# Altium schematic sheet Schematic.SchDoc
size A2; SheetNumber: 1; SheetTotal: 1
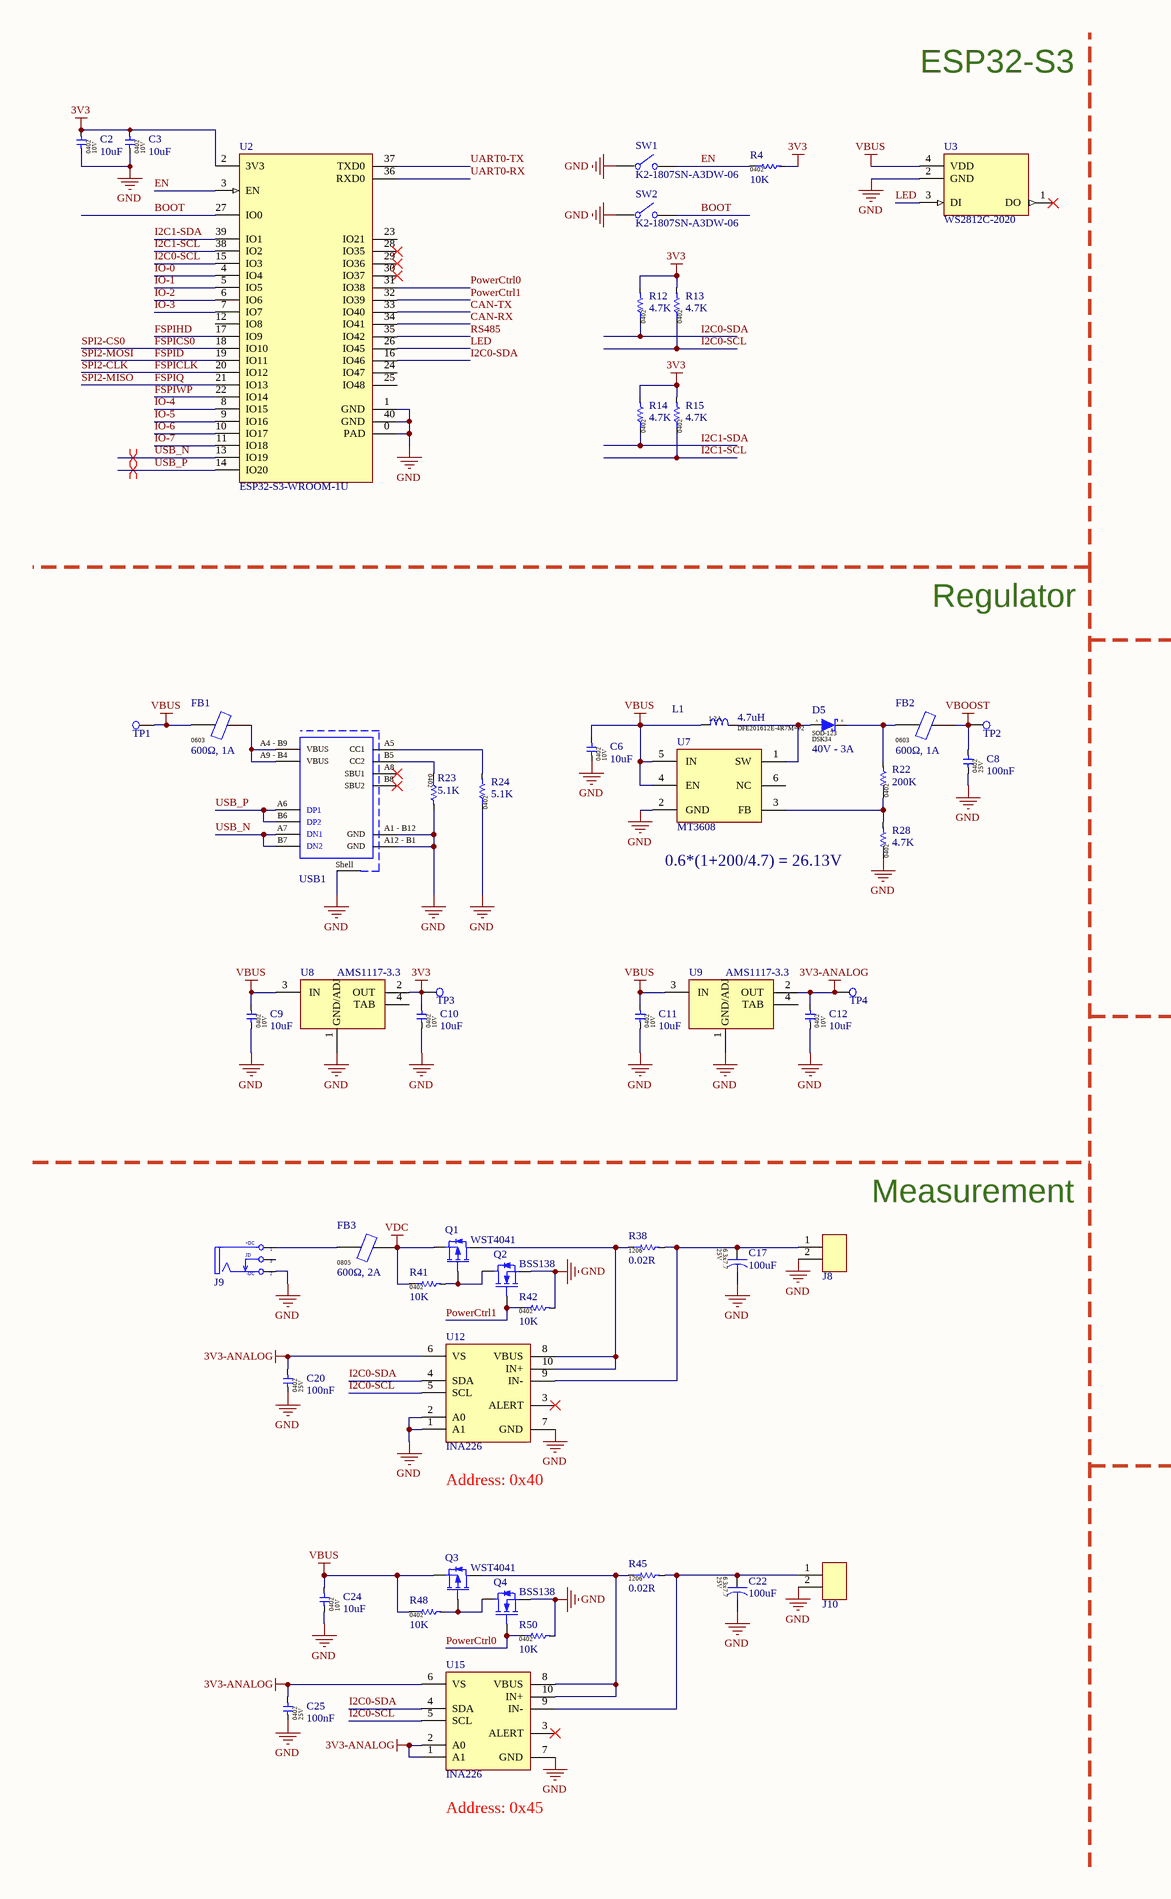
[diagram p0: Schematic.SchDoc, left]
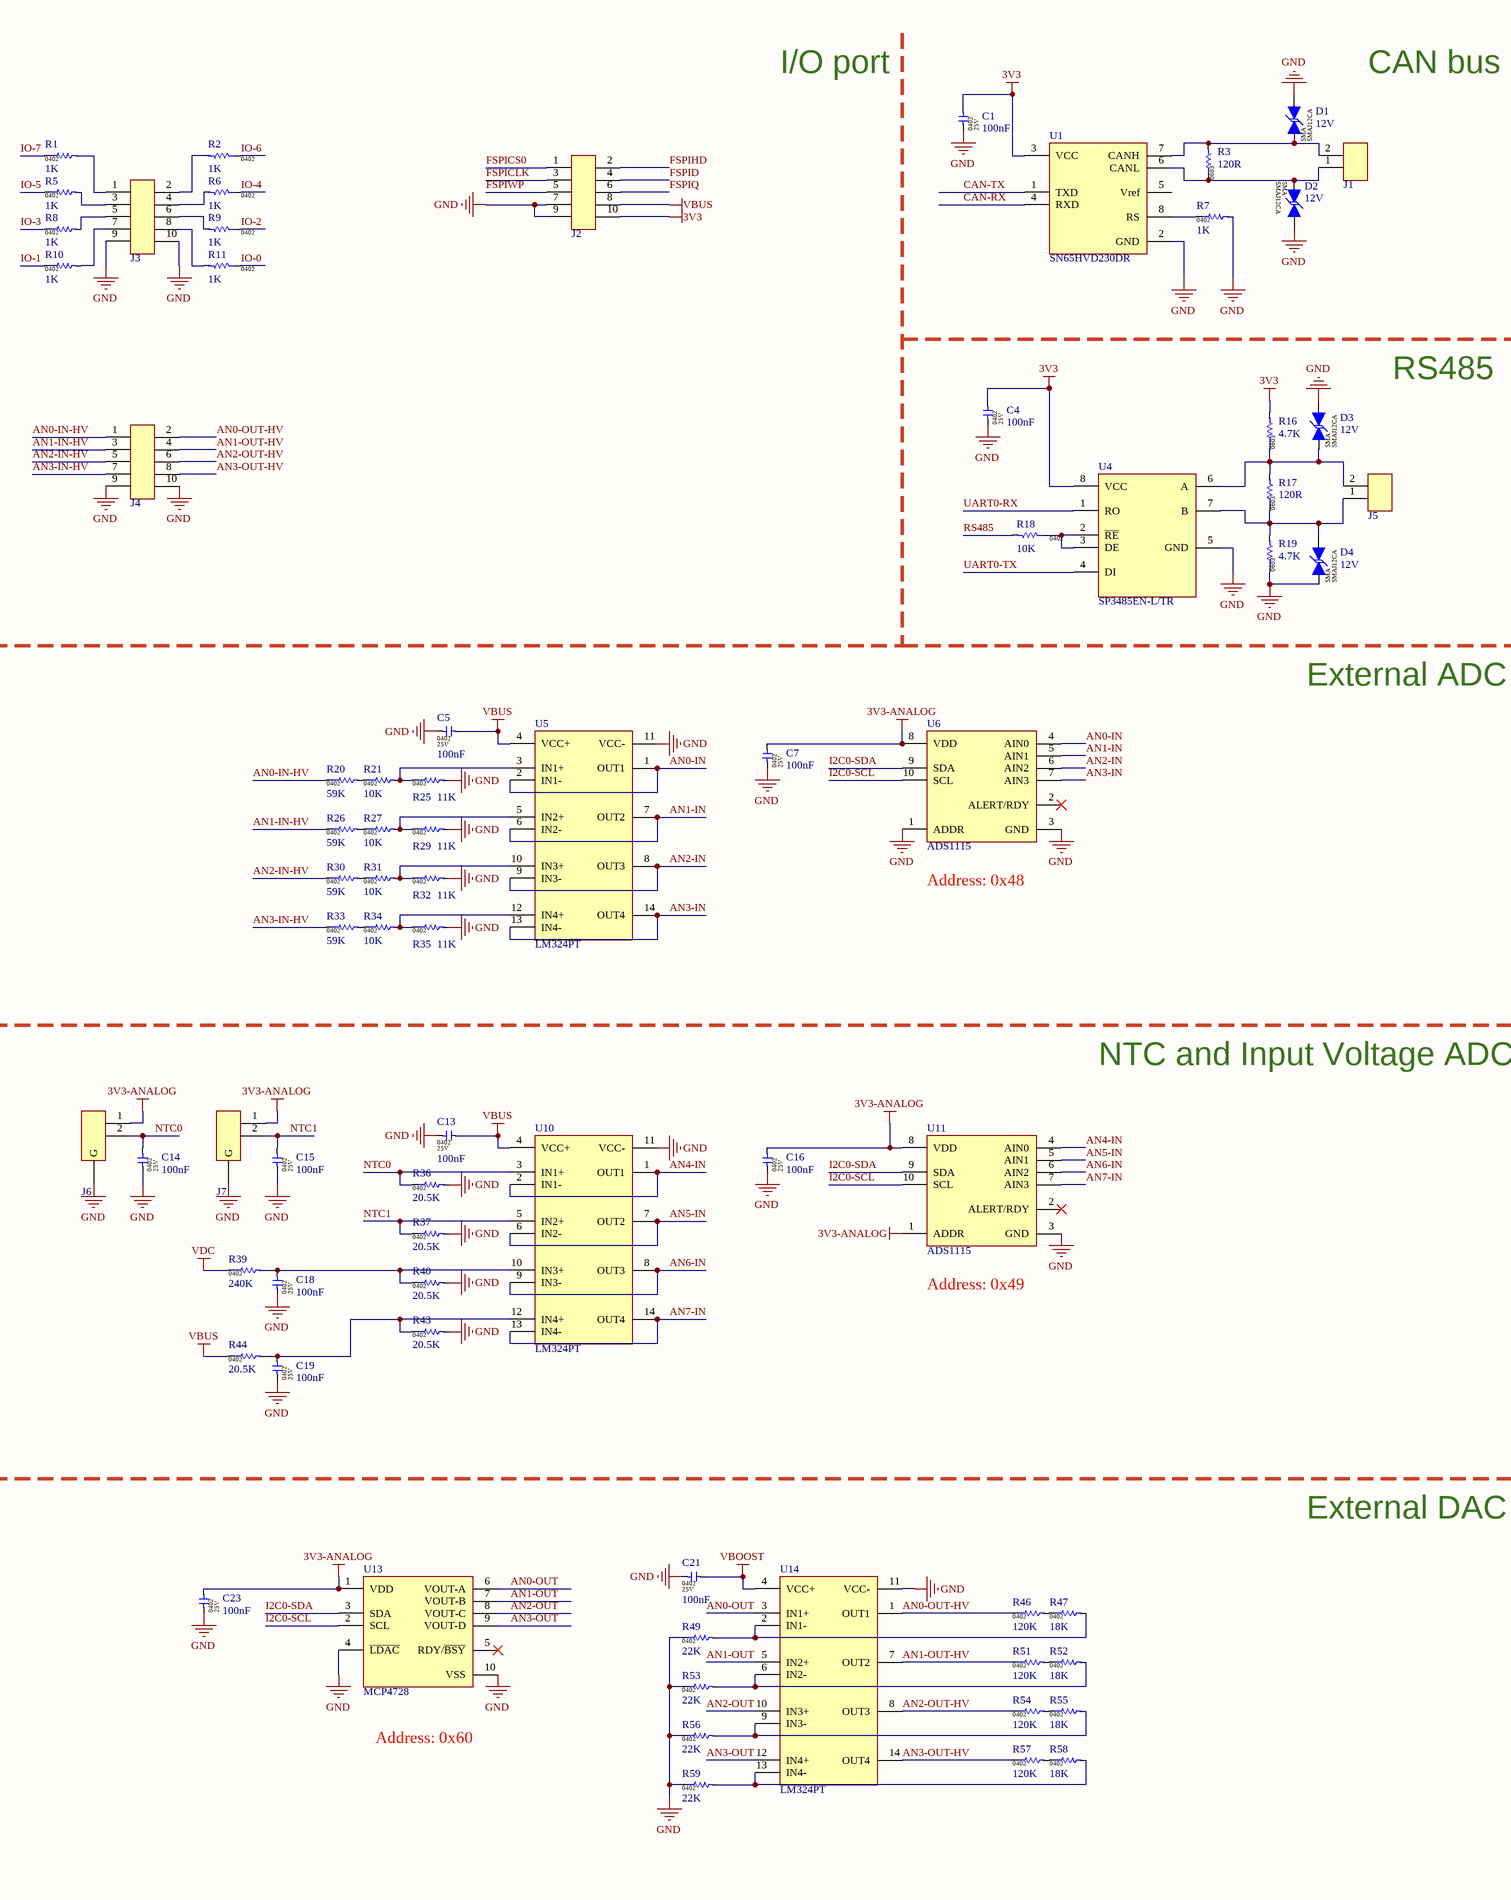
[diagram p1: Schematic.SchDoc, right]

## Parts
C1  100nF  [CAP-0402]
C2  10uF  [CAP-0402]
C3  10uF  [CAP-0402]
C4  100nF  [CAP-0402]
C5  100nF  [CAP-0402]
C6  10uF  [CAP-0402]
C7  100nF  [CAP-0402]
C8  100nF  [CAP-0402]
C9  10uF  [CAP-0402]
C10  10uF  [CAP-0402]
C11  10uF  [CAP-0402]
C12  10uF  [CAP-0402]
C13  100nF  [CAP-0402]
C14  100nF  [CAP-0402]
C15  100nF  [CAP-0402]
C16  100nF  [CAP-0402]
C17  100uF  [CAP-ALU-SMD-D]
C18  100nF  [CAP-0402]
C19  100nF  [CAP-0402]
C20  100nF  [CAP-0402]
C21  100nF  [CAP-0402]
C22  100uF  [CAP-ALU-SMD-D]
C23  100nF  [CAP-0402]
C24  10uF  [CAP-0402]
C25  100nF  [CAP-0402]
D1  12V  [SMA-DO-214AC (BI)]
D2  12V  [SMA-DO-214AC (BI)]
D3  12V  [SMA-DO-214AC (BI)]
D4  12V  [SMA-DO-214AC (BI)]
D5  40V - 3A  [SOD123]
FB1  600Ω, 1A  [Ferrite-0603]
FB2  600Ω, 1A  [Ferrite-0603]
FB3  600Ω, 2A  [Ferrite-0805]
J1  DB301V-5.0-2P-BU-S  [Terminal block 2P 5.0]  (value not drawn)
J2  IDC2.54-05-05PWS  [Conn IDC 10P-2.54H right]  (value not drawn)
J3  IDC2.54-05-05PWS  [Conn IDC 10P-2.54H right]  (value not drawn)
J4  IDC2.54-05-05PWS  [Conn IDC 10P-2.54H right]  (value not drawn)
J5  DB301V-5.0-2P-BU-S  [Terminal block 2P 5.0]  (value not drawn)
J6  S2B-XH-SM4-TB(LF)(SN)  [XH-2.54-2Pin-SMT]  (value not drawn)
J7  S2B-XH-SM4-TB(LF)(SN)  [XH-2.54-2Pin-SMT]  (value not drawn)
J8  DB301V-5.0-2P-BU-S  [Terminal block 2P 5.0]  (value not drawn)
J9  DC-044A-2.5A-2.0  [Jack DC 5.5-2.5mm]  (value not drawn)
J10  DB301V-5.0-2P-BU-S  [Terminal block 2P 5.0]  (value not drawn)
L1  4.7uH  [IND-201612]
Q1  WST4041  [SOT23-3]
Q2  BSS138  [SOT23-3]
Q3  WST4041  [SOT23-3]
Q4  BSS138  [SOT23-3]
R1  1K  [RES-0402]
R2  1K  [RES-0402]
R3  120R  [RES-0603]
R4  10K  [RES-0402]
R5  1K  [RES-0402]
R6  1K  [RES-0402]
R7  1K  [RES-0402]
R8  1K  [RES-0402]
R9  1K  [RES-0402]
R10  1K  [RES-0402]
R11  1K  [RES-0402]
R12  4.7K  [RES-0402]
R13  4.7K  [RES-0402]
R14  4.7K  [RES-0402]
R15  4.7K  [RES-0402]
R16  4.7K  [RES-0603]
R17  120R  [RES-0603]
R18  10K  [RES-0402]
R19  4.7K  [RES-0603]
R20  59K  [RES-0402]
R21  10K  [RES-0402]
R22  200K  [RES-0402]
R23  5.1K  [RES-0402]
R24  5.1K  [RES-0402]
R25  11K  [RES-0402]
R26  59K  [RES-0402]
R27  10K  [RES-0402]
R28  4.7K  [RES-0402]
R29  11K  [RES-0402]
R30  59K  [RES-0402]
R31  10K  [RES-0402]
R32  11K  [RES-0402]
R33  59K  [RES-0402]
R34  10K  [RES-0402]
R35  11K  [RES-0402]
R36  20.5K  [RES-0402]
R37  20.5K  [RES-0402]
R38  0.02R  [RES-1206]
R39  240K  [RES-0402]
R40  20.5K  [RES-0402]
R41  10K  [RES-0402]
R42  10K  [RES-0402]
R43  20.5K  [RES-0402]
R44  20.5K  [RES-0402]
R45  0.02R  [RES-1206]
R46  120K  [RES-0402]
R47  18K  [RES-0402]
R48  10K  [RES-0402]
R49  22K  [RES-0402]
R50  10K  [RES-0402]
R51  120K  [RES-0402]
R52  18K  [RES-0402]
R53  22K  [RES-0402]
R54  120K  [RES-0402]
R55  18K  [RES-0402]
R56  22K  [RES-0402]
R57  120K  [RES-0402]
R58  18K  [RES-0402]
R59  22K  [RES-0402]
SW1  K2-1807SN-A3DW-06  [SW - TYPE 3]
SW2  K2-1807SN-A3DW-06  [SW - TYPE 3]
TP1  N/A  [Test point]  (value not drawn)  (no BOM)
TP2  N/A  [Test point]  (value not drawn)  (no BOM)
TP3  N/A  [Test point]  (value not drawn)  (no BOM)
TP4  N/A  [Test point]  (value not drawn)  (no BOM)
U1  SN65HVD230DR  [SOP-8]
U2  ESP32-S3-WROOM-1U  [ESP32-S3-WROOM-1U]
U3  WS2812C-2020  [WS2812C-2020]
U4  SP3485EN-L/TR  [SOP-8]
U5  LM324PT  [TSSOP-14]
U6  ADS1115  [VSSOP-10]
U7  MT3608  [SOT23-6]
U8  AMS1117-3.3  [SOT223]
U9  AMS1117-3.3  [SOT223]
U10  LM324PT  [TSSOP-14]
U11  ADS1115  [VSSOP-10]
U12  INA226  [VSSOP-10]
U13  MCP4728  [MSOP-10]
U14  LM324PT  [TSSOP-14]
U15  INA226  [VSSOP-10]
USB1  918-418K2023S40001  [1 FEMALE USB -C 16]  (value not drawn)

## Nets
3V3: C1.2 C2.2 C3.2 C4.2 C10.2 J2.10 R4.2 R12.2 R13.2 R14.2 R15.2 R16.2 TP3.1 U1.3(VCC) U2.2(3V3) U4.8(VCC) U8.2(OUT)
3V3-ANALOG: C7.2 C12.2 C16.2 C20.2 C23.2 C25.2 J6.1 J7.1 TP4.1 U6.8(VDD) U9.2(OUT) U11.1(ADDR) U11.8(VDD) U12.6(VS) U13.1(VDD) U15.1(A1) U15.2(A0) U15.6(VS)
GND: C1.1 C2.1 C3.1 C4.1 C5.1 C6.1 C7.1 C8.1 C9.1 C10.1 C11.1 C12.1 C13.1 C14.1 C15.1 C16.1 C17.2 C18.1 C19.1 C20.1 C21.1 C22.2 C23.1 C24.1 C25.1 D1.2 D2.2 D3.2 D4.1 J2.7 J2.9 J3.9 J3.10 J4.9 J4.10 J6.0(G) J7.0(G) J8.2 J9.2(TN) J10.2 Q2.2(S) Q4.2(S) R7.2 R19.1 R23.2 R24.1 R25.2 R28.1 R29.2 R32.2 R35.2 R36.2 R37.2 R40.2 R42.2 R43.2 R49.1 R50.2 R53.1 R56.1 R59.1 SW1.1 SW2.1 U1.2(GND) U2.0(PAD) U2.1(GND) U2.40(GND) U3.2(GND) U4.5(GND) U5.11(VCC-) U6.1(ADDR) U6.3(GND) U7.2(GND) U8.1(GND/ADJ) U9.1(GND/ADJ) U10.11(VCC-) U11.3(GND) U12.1(A1) U12.2(A0) U12.7(GND) U13.4(~{LDAC}) U13.10(VSS) U14.11(VCC-) U15.7(GND) USB1.A1_-_B12(GND) USB1.A12_-_B1(GND) USB1.Shell(Shield)
VBOOST: C8.2 C21.2 FB2.2 TP2.1 U14.4(VCC+)
VBUS: C5.2 C6.2 C9.2 C11.2 C13.2 C24.2 FB1.1 J2.8 L1.2 Q3.2(S) R44.1 R48.1 TP1.1 U3.4(VDD) U5.4(VCC+) U7.4(EN) U7.5(IN) U8.3(IN) U9.3(IN) U10.4(VCC+)
VDC: FB3.2 Q1.2(S) R39.1 R41.1
AN0-IN: U5.1(OUT1) U5.2(IN1-) U6.4(AIN0)
AN0-IN-HV: J4.1 R20.1
AN0-OUT: U13.6(VOUT-A) U14.3(IN1+)
AN0-OUT-HV: J4.2 R46.1 U14.1(OUT1)
AN1-IN: U5.6(IN2-) U5.7(OUT2) U6.5(AIN1)
AN1-IN-HV: J4.3 R26.1
AN1-OUT: U13.7(VOUT-B) U14.5(IN2+)
AN1-OUT-HV: J4.4 R51.1 U14.7(OUT2)
AN2-IN: U5.8(OUT3) U5.9(IN3-) U6.6(AIN2)
AN2-IN-HV: J4.5 R30.1
AN2-OUT: U13.8(VOUT-C) U14.10(IN3+)
AN2-OUT-HV: J4.6 R54.1 U14.8(OUT3)
AN3-IN: U5.13(IN4-) U5.14(OUT4) U6.7(AIN3)
AN3-IN-HV: J4.7 R33.1
AN3-OUT: U13.9(VOUT-D) U14.12(IN4+)
AN3-OUT-HV: J4.8 R57.1 U14.14(OUT4)
AN4-IN: U10.1(OUT1) U10.2(IN1-) U11.4(AIN0)
AN5-IN: U10.6(IN2-) U10.7(OUT2) U11.5(AIN1)
AN6-IN: U10.8(OUT3) U10.9(IN3-) U11.6(AIN2)
AN7-IN: U10.13(IN4-) U10.14(OUT4) U11.7(AIN3)
BOOT: SW2.2 U2.27(IO0)
CAN-RX: U1.4(RXD) U2.34(IO41)
CAN-TX: U1.1(TXD) U2.33(IO40)
EN: R4.1 SW1.2 U2.3(EN)
FSPICLK: J2.3 U2.20(IO12)  [also labelled SPI2-CLK]
FSPICS0: J2.1 U2.18(IO10)  [also labelled SPI2-CS0]
FSPID: J2.4 U2.19(IO11)  [also labelled SPI2-MOSI]
FSPIHD: J2.2 U2.17(IO9)
FSPIQ: J2.6 U2.21(IO13)  [also labelled SPI2-MISO]
FSPIWP: J2.5 U2.22(IO14)
I2C0-SCL: R13.1 U2.15(IO3) U6.10(SCL) U11.10(SCL) U12.5(SCL) U13.2(SCL) U15.5(SCL)
I2C0-SDA: R12.1 U2.16(IO46) U6.9(SDA) U11.9(SDA) U12.4(SDA) U13.3(SDA) U15.4(SDA)
I2C1-SCL: R15.1 U2.38(IO2)
I2C1-SDA: R14.1 U2.39(IO1)
IO-0: R11.1 U2.4(IO4)
IO-1: R10.1 U2.5(IO5)
IO-2: R9.1 U2.6(IO6)
IO-3: R8.1 U2.7(IO7)
IO-4: R6.1 U2.8(IO15)
IO-5: R5.1 U2.9(IO16)
IO-6: R2.1 U2.10(IO17)
IO-7: R1.1 U2.11(IO18)
LED: U2.26(IO45) U3.3(DI)
NTC0: C14.2 J6.2 R36.1 U10.3(IN1+)
NTC1: C15.2 J7.2 R37.1 U10.5(IN2+)
PowerCtrl0: Q4.1(G) R50.1 U2.31(IO38)
PowerCtrl1: Q2.1(G) R42.1 U2.32(IO39)
RS485: R18.2 U2.35(IO42)
UART0-RX: U2.36(RXD0) U4.1(RO)
UART0-TX: U2.37(TXD0) U4.4(DI)
USB_N: U2.13(IO19) USB1.A7(DN1) USB1.B7(DN2)
USB_P: U2.14(IO20) USB1.A6(DP1) USB1.B6(DP2)
NetC17_1: C17.1 J8.1 R38.2 U12.9(IN-)
NetC18_2: C18.2 R39.2 R40.1 U10.10(IN3+)
NetC19_2: C19.2 R43.1 R44.2 U10.12(IN4+)
NetC22_1: C22.1 J10.1 R45.2 U15.9(IN-)
NetD1_1: D1.1 J1.2 R3.2 U1.7(CANH)
NetD2_1: D2.1 J1.1 R3.1 U1.6(CANL)
NetD3_1: D3.1 J5.2 R16.1 R17.2 U4.6(A)
NetD4_2: D4.2 J5.1 R17.1 R19.2 U4.7(B)
NetD5_1: D5.1(Cathode) FB2.1 R22.2
NetD5_2: D5.2(Anode) L1.1 U7.1(SW)
NetFB1_2: FB1.2 USB1.A4_-_B9(VBUS) USB1.A9_-_B4(VBUS)
NetFB3_1: FB3.1 J9.1(T)
NetJ3_1: J3.1 R1.2
NetJ3_2: J3.2 R2.2
NetJ3_3: J3.3 R5.2
NetJ3_4: J3.4 R6.2
NetJ3_5: J3.5 R8.2
NetJ3_6: J3.6 R9.2
NetJ3_7: J3.7 R10.2
NetJ3_8: J3.8 R11.2
NetQ1_1: Q1.1(G) Q2.3(D) R41.2
NetQ1_3: Q1.3(D) R38.1 U12.8(VBUS) U12.10(IN+)
NetQ3_1: Q3.1(G) Q4.3(D) R48.2
NetQ3_3: Q3.3(D) R45.1 U15.8(VBUS) U15.10(IN+)
NetR7_1: R7.1 U1.8(RS)
NetR18_1: R18.1 U4.2(~{RE}) U4.3(DE)
NetR20_2: R20.2 R21.1
NetR21_2: R21.2 R25.1 U5.3(IN1+)
NetR22_1: R22.1 R28.2 U7.3(FB)
NetR23_1: R23.1 USB1.B5(CC2)
NetR24_2: R24.2 USB1.A5(CC1)
NetR26_2: R26.2 R27.1
NetR27_2: R27.2 R29.1 U5.5(IN2+)
NetR30_2: R30.2 R31.1
NetR31_2: R31.2 R32.1 U5.10(IN3+)
NetR33_2: R33.2 R34.1
NetR34_2: R34.2 R35.1 U5.12(IN4+)
NetR46_2: R46.2 R47.1
NetR47_2: R47.2 R49.2 U14.2(IN1-)
NetR51_2: R51.2 R52.1
NetR52_2: R52.2 R53.2 U14.6(IN2-)
NetR54_2: R54.2 R55.1
NetR55_2: R55.2 R56.2 U14.9(IN3-)
NetR57_2: R57.2 R58.1
NetR58_2: R58.2 R59.2 U14.13(IN4-)

Not connected (* = marked no-connect by the designer): J9 3(S); U1 5(Vref); U2 12(IO8) 23(IO21) 24(IO47) 25(IO48) 28(IO35)* 29(IO36)* 30(IO37)*; U3 1(DO)*; U6 2(ALERT/RDY)*; U7 6(NC); U8 4(TAB); U9 4(TAB); U11 2(ALERT/RDY)*; U12 3(ALERT)*; U13 5(RDY/~{BSY})*; U15 3(ALERT)*; USB1 A8(SBU1)* B8(SBU2)*

## Layout directives
differential pair: USB_N, USB_P

## Notes on the sheet
- ESP32-S3
- I/O port
- CAN bus
- RS485
- Regulator
- External ADC
- (near R28) 0.6*(1+200/4.7) = 26.13V
- (near U6) Address: 0x48
- NTC and Input Voltage ADC
- Measurement
- (near U11) Address: 0x49
- (near U12) Address: 0x40
- External DAC
- Address: 0x60
- (near U15) Address: 0x45
- (in symbol DC-044A-2.5A-2.0) +DC; JD; -DC
- (in symbol DSK34) A; K

## Library data of the parts
C1 C4 C5 C7 C8 C13-C16 C18-C21 C23 C25 = 0402X104K250CT: 100nF ±10% 25V X5R 0402 Multilayer Ceramic Capacitors MLCC - SMD/SMT RoHS; Manufacture: WALSIN; Package / Case: 0402; Component type: Capacitor; Manufacture part: 0402X104K250CT; Capacitor value: 100nF; Voltage: 25V; Package: 0402
C2 C3 C6 C9-C12 C24 = CL05A106MP5NUNC: 10V 10uF X5R ±20% 0402 Multilayer Ceramic Capacitors MLCC - SMD/SMT ROHS; Manufacture: Samsung; Package / Case: 0402; Component type: Capacitor; Manufacture part: CL05A106MP5NUNC; Capacitor value: 10uF; Voltage: 10V; Package: 0402
C17 C22 = RVT1E101M0607: 7.7mm 6.3mm 25V 100uF 2000hrs 105℃ -55℃~+105℃ SMD,6.3x7.7mm Aluminum Electrolytic Capacitors - SMD ROHS; Manufacture: Honor Elec; Package / Case: 0402; Component type: Capacitor; Manufacture part: RVT1E101M0607; Capacitor value: 100uF; Voltage: 25V; Package: 6.3x7.7
D1-D4 = SMAJ12CA: ESD Suppressors / TVS Diodes 400W 12V 5% Bi-Directional; Manufacture: MDD（Microdiode Electronics）; Manufacture part: SMAJ12CA; Type: TVS/ESD Bi diode; Diode value: 12V; Package: SMA; Datasheet: https://www.mouser.com/datasheet/2/240/Littelfuse_TVS_Diode_SMAJ_Datasheet_pdf-540740.pdf
D5 = DSK34: 40V 3A 550mV @ 3A SOD-123 Schottky Barrier Diodes (SBD) RoHS; Manufacture part: DSK34; Manufacture: MDD（Microdiode Electronics）; Type: Schottky diode; Diode value: 40V - 3A; Package: SOD-123; Datasheet: https://datasheet.lcsc.com/lcsc/1903051130_MDD-Jiangsu-Yutai-Elec-DSK34_C41029.pdf
FB1 FB2 = UPZ1608E601-1R0TF: 600Ω @ 100MHz 1A 1 150mΩ 0603 Ferrite Beads RoHS; Manufacture: SUNLORD; Manufacture part: UPZ1608E601-1R0TF; Package: 0603; Value: 600Ω, 1A; Datasheet: https://datasheet.lcsc.com/lcsc/2110092130_Sunlord-UPZ1608E601-1R0TF_C133527.pdf
FB3 = CBM201209U601T: 600Ω @ 100MHz 2A ±25% 0805 Ferrite Beads ROHS; Manufacture: FH (Guangdong Fenghua Advanced Tech); Manufacture part: CBM201209U601T; Package: 0805; Value: 600Ω, 2A; Datasheet: https://datasheet.lcsc.com/lcsc/1811061717_FH--Guangdong-Fenghua-Advanced-Tech-CBM201209U601T_C139168.pdf
J1 J5 J8 J10 = DB301V-5.0-2P-BU-S: 1.5 -40℃~+120℃ 17.5A 250V Blue Straight pin 5mm, Screw terminal ROHS; Manufacture: DIBO; Manufacture part: DB301V-5.0-2P-BU-S; Type: Terminal block; Datasheet: https://datasheet.lcsc.com/lcsc/1912111437_DIBO-DB301V-5-0-2P-BU-S_C395882.pdf
J2-J4 = IDC2.54-05-05PWS: 2.54mm 3A 250V 5 Right-Angle -40℃~+105℃ 2x5P 2.54mm Push - Pull 2 Plugin,P=2.54mm IDC Connectors ROHS; Manufacture: XUNPU; Manufacture part: IDC2.54-05-05PWS; Type: Pin Header; Datasheet: https://datasheet.lcsc.com/lcsc/2308151416_XUNPU-IDC2-54-05-05PWS_C7501635.pdf
J6 J7 = S2B-XH-SM4-TB(LF)(SN): XH Header Male Pin 0.098"(2.50mm) 2 SMD,P=2.5mm Wire To Board / Wire To Wire Connector RoHS; Manufacture: JST Sales America; Manufacture part: S2B-XH-SM4-TB(LF)(SN); Type: XH
J9 = DC-044A-2.5A-2.0: DC Power Receptacle 260℃ Brass -20℃~+70℃ 2mm 6mm 2.5A 24V Plugin DC Power Connector ROHS; Manufacture: XKB Connectivity; Manufacture part: DC-044A-2.5A-2.0; Type: DC; Datasheet: https://datasheet.lcsc.com/lcsc/2110151630_XKB-Connection-DC-044A-2-5A-2-0_C319095.pdf
L1 = DFE201612E-4R7M=P2: 1.2A 4.7uH ±20% 1.8A 0806 Power Inductors ROHS; Manufacture: Murata Electronics; DCR: 0.252 Ω; Manufacture part: DFE201612E-4R7M=P2; Inductance value: 4.7uH; Irms max: 1.2A; Package: 201612; Datasheet: https://datasheet.lcsc.com/lcsc/2308111422_Murata-Electronics-DFE201612E-4R7M-P2_C3223763.pdf
Q1 Q3 = WST4041: 1.4W 40V 6A 2.2V 250uA P Channel 0.04Ω 3A,10V SOT-23(SOT-23-3) MOSFETs ROHS; Manufacture: Winsok Semicon; Type: P-Mosfet; Manufacture part: WST4041; Package: SOT23-3; Datasheet: https://datasheet.lcsc.com/lcsc/1811012118_Winsok-Semicon-WST4041_C148357.pdf
Q2 Q4 = BSS138: N-Channel 50V 220mA 1.5V @ 1mA 3.5Ω @ 220mA,10V 360mW SOT-23(SOT-23-3) MOSFETs RoHS; Manufacture: Shikues; Type: N-Mosfet; Manufacture part: BSS138; Package: SOT23-3; Datasheet: https://datasheet.lcsc.com/lcsc/1811101310_Shikues-BSS138_C112239.pdf
R1 R2 R5-R11 = WR04X1001FTL: 1kΩ ±1% 1/16W ±100ppm/℃ 0402 Chip Resistor - Surface Mount RoHS; Manufacture: WALSIN; Package / Case: 0201; Component type: Resistor; Manufacture part: WR04X1001FTL; Resistor value: 1K; Package: 0402
R3 R17 = RC0603FR-07120RL: 100mW 75V ±100ppm/℃ ±1% -55℃~+155℃ 120Ω 0603 Chip Resistor - Surface Mount ROHS; Manufacture: YAGEO; Package / Case: 0201; Component type: Resistor; Manufacture part: RC0603FR-07120RL; Resistor value: 120R; Package: 0603
R4 R18 R21 R27 R31 R34 R41 R42 R48 R50 = WR04X1002FTL: 10kΩ ±1% 1/16W ±100ppm/℃ 0402 Chip Resistor - Surface Mount RoHS; Manufacture: WALSIN; Package / Case: 0201; Component type: Resistor; Manufacture part: WR04X1002FTL; Resistor value: 10K; Package: 0402
R12-R15 R28 = WR04X4701FTL: 4.7kΩ ±1% 1/16W ±100ppm/℃ 0402 Chip Resistor - Surface Mount RoHS; Manufacture: WALSIN; Package / Case: 0201; Component type: Resistor; Manufacture part: WR04X4701FTL; Resistor value: 4.7K; Package: 0402
R16 R19 = WR06X4701FTL: 4.7kΩ ±1% 0.1W ±100ppm/℃ 0603 Chip Resistor - Surface Mount RoHS; Manufacture: WALSIN; Package / Case: 0201; Component type: Resistor; Manufacture part: WR06X4701FTL; Resistor value: 4.7K; Package: 0603
R20 R26 R30 R33 = WR04X5902FTL: ±1% 1/16W 50V ±100ppm/℃ -55℃~+155℃ 59kΩ 0402 Chip Resistor - Surface Mount ROHS; Manufacture: WALSIN; Package / Case: 0201; Component type: Resistor; Manufacture part: WR04X5902FTL; Resistor value: 59K; Package: 0402
R22 = WR04X2003FTL: 200kΩ ±1% 1/16W ±100ppm/℃ 0402 Chip Resistor - Surface Mount RoHS; Manufacture: WALSIN; Package / Case: 0201; Component type: Resistor; Manufacture part: WR04X2003FTL; Resistor value: 200K; Package: 0402
R23 R24 = WR04X5101FTL: 5.1kΩ ±1% 1/16W ±100ppm/℃ 0402 Chip Resistor - Surface Mount RoHS; Manufacture: WALSIN; Package / Case: 0201; Component type: Resistor; Manufacture part: WR04X5101FTL; Resistor value: 5.1K; Package: 0402
R25 R29 R32 R35 = RC0402FR-0711KL: 62.5mW Thick Film Resistors 50V ±100ppm/℃ ±1% 11kΩ 0402 Chip Resistor - Surface Mount ROHS; Manufacture: YAGEO; Package / Case: 0201; Component type: Resistor; Manufacture part: RC0402FR-0711KL; Resistor value: 11K; Package: 0402
R36 R37 R40 R43 R44 = WR04X2052FTL: ±1% 20.5kΩ 1/16W ±100ppm/℃ 0402 Chip Resistor - Surface Mount ROHS; Manufacture: WALSIN; Package / Case: 0201; Component type: Resistor; Manufacture part: WR04X2052FTL; Resistor value: 20.5K; Package: 0402
R38 R45 = PA1206FRF470R02L: 1W ±100ppm/℃ ±1% 20mΩ 1206 Chip Resistor - Surface Mount ROHS; Manufacture: YAGEO; Package / Case: 0201; Component type: Resistor; Manufacture part: PA1206FRF470R02L; Resistor value: 0.02R; Package: 1206
R39 = RC0402FR-07240KL: 62.5mW Thick Film Resistors ±100ppm/℃ ±1% 240kΩ 0402 Chip Resistor - Surface Mount ROHS; Manufacture: YAGEO; Package / Case: 0201; Component type: Resistor; Manufacture part: RC0402FR-07240KL; Resistor value: 240K; Package: 0402
R46 R51 R54 R57 = WR04X1203FTL: 120kΩ ±1% 1/16W ±100ppm/℃ 0402 Chip Resistor - Surface Mount RoHS; Manufacture: WALSIN; Package / Case: 0201; Component type: Resistor; Manufacture part: WR04X1203FTL; Resistor value: 120K; Package: 0402
R47 R52 R55 R58 = WR04X1802FTL: ±1% 1/16W 50V ±100ppm/℃ -55℃~+155℃ 18kΩ 0402 Chip Resistor - Surface Mount ROHS; Manufacture: WALSIN; Package / Case: 0201; Component type: Resistor; Manufacture part: WR04X1802FTL; Resistor value: 18K; Package: 0402
R49 R53 R56 R59 = WR04X2202FTL: 22kΩ 1/16W ±1% 0402 Chip Resistor - Surface Mount ROHS; Manufacture: WALSIN; Package / Case: 0201; Component type: Resistor; Manufacture part: WR04X2202FTL; Resistor value: 22K; Package: 0402
SW1 SW2 = K2-1807SN-A3DW-06: SMD,3×4×2.0mm Tactile Switches RoHS; Manufacture: Korean Hroparts Elec; Manufacture part: K2-1807SN-A3DW-06; Type: Tactile Switches; Datasheet: https://datasheet.lcsc.com/lcsc/2008221234_XUNPU-TS-1088-AR02016_C720477.pdf
TP1-TP4 = N/A: A point used for measure.; Manufacture part: N/A; Manufacture: N/A; Type: Test point
U1 = SN65HVD230DR: 3.3-V CAN Bus Transceivers; Manufacture: Texas Instruments; Manufacture part: SN65HVD230DR; Package: SOP-8; Datasheet: https://www.ti.com/lit/ds/symlink/sn65hvd230.pdf?ts=1662996416638
U2 = ESP32-S3-WROOM-1U: Module WiFi Modules ROHS; Manufacture: Espressif Systems; Manufacture part: ESP32-S3-WROOM-1U; Package: Module; Datasheet: https://datasheet.lcsc.com/lcsc/2206281830_Espressif-Systems-ESP32-S3-WROOM-1U-N4R2_C3013942.pdf
U3 = WS2812C-2020: 2.0x2.0mm Light Emitting Diodes (LED); Manufacture: Worldsemi; Manufacture part: WS2812C-2020; Color: RGB; Package: N/A; Datasheet: https://datasheet.lcsc.com/lcsc/2012110135_Worldsemi-WS2812C-2020_C965556.pdf
U4 = SP3485EN-L/TR: RS-422/RS-485 Interface IC 3.3V LoPwr Half-Dup RS485w/10Mbps Data; Manufacture: MaxLinear; Manufacture part: SP3485EN-L/TR; Package: SOP-8; Datasheet: https://www.mouser.com/datasheet/2/146/sp3485-1816391.pdf
U5 U10 U14 = LM324PT: Low-power quad operational amplifiers; Manufacture: STMicroelectronics; Manufacture part: LM324PT; Package: TSSOP-14; Datasheet: https://www.st.com/content/ccc/resource/technical/document/datasheet/bd/fc/46/43/26/8f/40/7f/CD00001046.pdf/files/CD00001046.pdf/jcr:content/translations/en.CD00001046.pdf
U6 U11 = ADS1115: ADS111x Ultra-Small, Low-Power, I2C-Compatible, 860-SPS, 16-Bit ADCs With Internal Reference, Oscillator, and Programmable Comparator; Manufacture: Texas Instruments; Manufacture part: ADS1115; Package: VSSOP-10; Datasheet: https://www.ti.com/lit/ds/symlink/ads1115.pdf?ts=1713139289043&ref_url=https%253A%252F%252Fwww.google.com%252F
U7 = MT3608: High Efficiency 1.2MHz 2A Step Up Converter, 2V to 24V Input, Up to 28V Output; Manufacture: AEROSEMI; Manufacture part: MT3608; Type: Boost; Package: SOT23-6; Datasheet: https://www.lcsc.com/datasheet/lcsc_datasheet_1811151539_XI-AN-Aerosemi-Tech-MT3608_C84817.pdf
U8 U9 = AMS1117-3.3: Fixed 15V 3.3V 1.3V @ 800mA SOT-223 Dropout Regulators(LDO) RoHS; Manufacture: Advanced Monolithic Systems; Manufacture part: AMS1117-3.3; Type: LDO; Package: SOT223; Datasheet: https://datasheet.lcsc.com/lcsc/1811021917_Advanced-Monolithic-Systems-AMS1117_C6188.pdf
U12 U15 = INA226: INA226 High-Side or Low-Side Measurement, Bi-Directional Current and Power Monitor with I2C Compatible Interface; Manufacture: Texas Instruments; Manufacture part: INA226; Package: VSSOP-10; Datasheet: https://www.ti.com/lit/ds/symlink/ina226.pdf?ts=1713129002784
U13 = MCP4728: 12-Bit Quad Output DAC w/EEPROM and I2; Manufacture: Microchip; Manufacture part: MCP4728; Package: MSOP-10; Datasheet: https://ww1.microchip.com/downloads/aemDocuments/documents/OTH/ProductDocuments/DataSheets/22187E.pdf
USB1 = 918-418K2023S40001: USB - Type C Female 16 SMD USB Connectors RoHS; Manufacture: Jing Extension of the Electronic Co.; Manufacture part: 918-418K2023S40001; Type: USB-C; Datasheet: https://datasheet.lcsc.com/lcsc/2103051833_Jing-Extension-of-the-Electronic-Co-918-418K2023S40001_C167321.pdf